# EAGLE design Design (EAGLE 9.6.2)
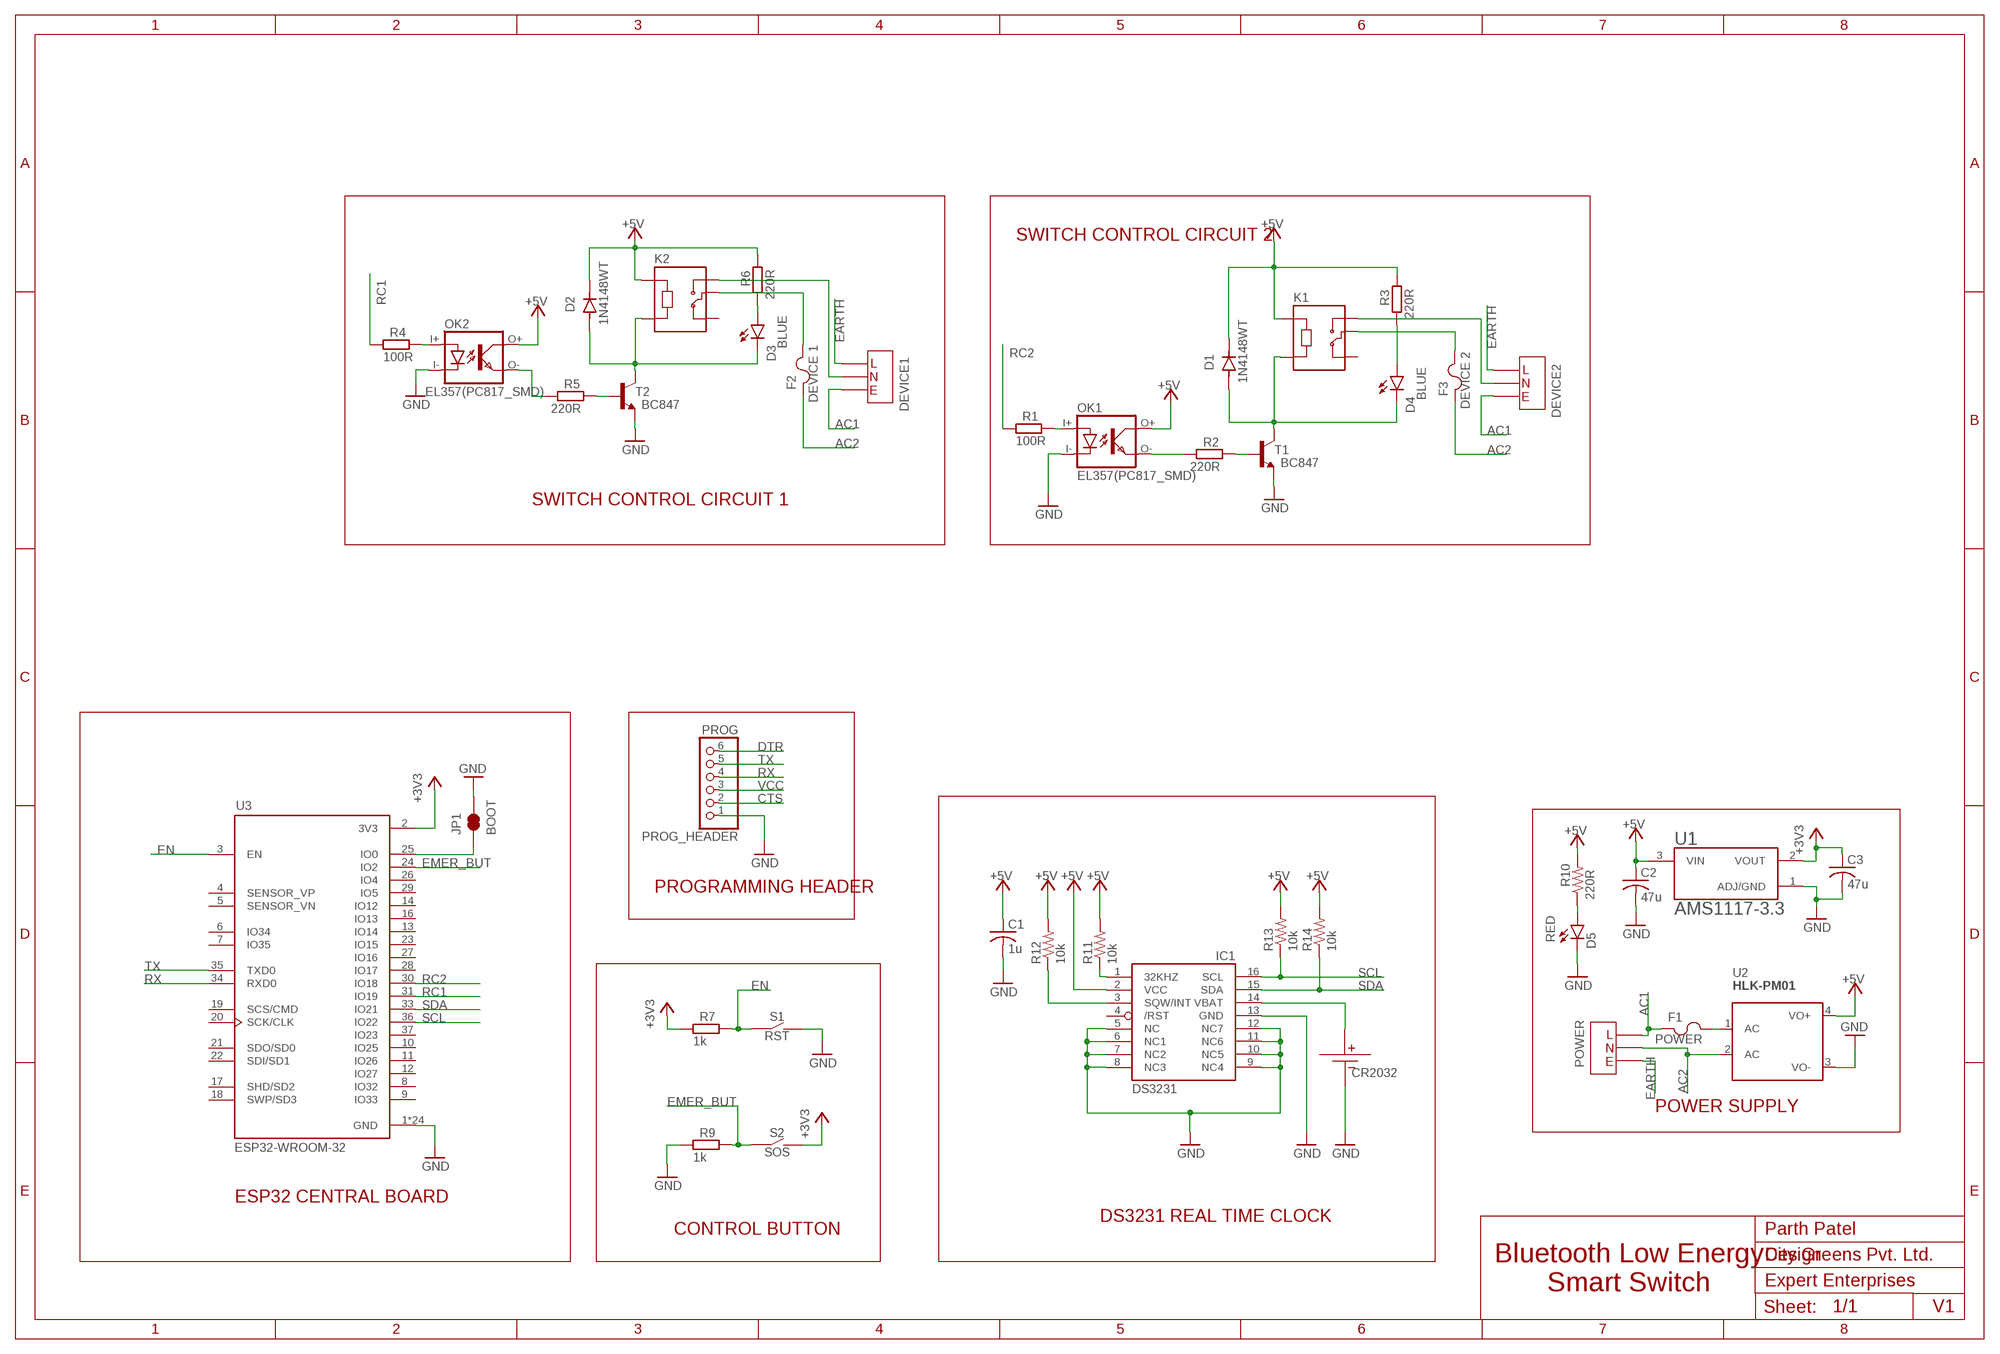
[diagram p0: schematic, sheet 1]

## Parts
C1  1u  C-USC0805  [C0805]
C2  47u  C-USC0805  [C0805]
C3  47u  C-USC0805  [C0805]
CR2032  CR3032-METAL  [CR2032-METAL]
D1  1N4148WT  [SODFL1608X70N]
D2  1N4148WT  [SODFL1608X70N]
D3  BLUE  LEDCHIP-LED0603  [CHIP-LED0603]
D4  BLUE  LEDCHIP-LED0603  [CHIP-LED0603]
D5  RED  LEDCHIP-LED0603  [CHIP-LED0603]
DEVICE1  DEVICE 1  AC_SMD_PADS  [AC_SMD_PADS]
DEVICE2  DEVICE 2  AC_SMD_PADS  [AC_SMD_PADS]
F1  POWER  TX.XA_RECTANGULAR_FUSE  [TXXA-RECTANGULAR-FUSE]
F2  DEVICE 1  TX.XA_RECTANGULAR_FUSE  [TXXA-RECTANGULAR-FUSE]
F3  DEVICE 2  TX.XA_RECTANGULAR_FUSE  [TXXA-RECTANGULAR-FUSE]
IC1  DS3231/SO  [SO16W]
JP1  BOOT  JUMPER-SMT_2_NC_TRACE_NO-SILK  [SMT-JUMPER_2_NC_TRACE_NO-SILK]
K1  SRD-05VDC-SL-C  [RELAY_SRD-05VDC-SL-C]
K2  SRD-05VDC-SL-C  [RELAY_SRD-05VDC-SL-C]
OK1  EL357(PC817_SMD)  [SOP254P715X240-4N]
OK2  EL357(PC817_SMD)  [SOP254P715X240-4N]
POWER  POWER  AC_SMD_PADS  [AC_SMD_PADS]
PROG_HEADER  PROG  PINHD-1X6  [1X06]
R1  100R  R-EU_R0805  [R0805]
R2  220R  R-EU_R0805  [R0805]
R3  220R  R-EU_R0805  [R0805]
R4  100R  R-EU_R0805  [R0805]
R5  220R  R-EU_R0805  [R0805]
R6  220R  R-EU_R0805  [R0805]
R7  1k  R-EU_R0805  [R0805]
R9  1k  R-EU_R0805  [R0805]
R10  220R  R-US_R0805  [R0805]
R11  10k  R-US_R0805  [R0805]
R12  10k  R-US_R0805  [R0805]
R13  10k  R-US_R0805  [R0805]
R14  10k  R-US_R0805  [R0805]
S1  RST  4.5X4.5-SMD-TACTILE-SWITCH  [SMD-4.5X4.5-TACTILE-PUSH-BUTTON]
S2  SOS  4.5X4.5-SMD-TACTILE-SWITCH  [SMD-4.5X4.5-TACTILE-PUSH-BUTTON]
T1  BC847  [SOT23]
T2  BC847  [SOT23]
U1  AMS1117-3.3  [SOT229P700X180-4N]
U2  HLK-PM01  [HLK-PM01]
U3  ESP32-WROOM-32  [MODULE_ESP32-WROOM-32]

## Nets
+3V3: C3.1 R7.1 S2.2.1(S2) S2.2.2(S2) U1.2(VOUT) U3.2(3V3)
+5V: C1.1 C2.1 D1.D+ D2.D+ IC1.2(VCC) K1.A1 K2.A1 OK1.O+ OK2.O+ R3.2 R6.2 R10.2 R11.2 R12.2 R13.2 R14.2 U1.3(VIN) U2.4(VO+)
AC1: DEVICE1.P$1 DEVICE2.P$1 F1.P$1 POWER.P$1
AC2: F2.P$1 F3.P$1 POWER.P$2 U2.2(AC)
CTS: PROG_HEADER.2
DTR: PROG_HEADER.6
EARTH: DEVICE1.P$3 DEVICE2.P$3 POWER.P$3
EMER_BUT: R9.2 S2.1.1(S1) S2.1.2(S1) U3.24(IO2)
EN: R7.2 S1.1.1(S1) S1.1.2(S1) U3.3(EN)
GND: C1.2 C2.2 C3.2 CR2032.-VE1(-VE) CR2032.-VE2(-VE) D5.C IC1.5(NC) IC1.6(NC1) IC1.7(NC2) IC1.8(NC3) IC1.9(NC4) IC1.10(NC5) IC1.11(NC6) IC1.12(NC7) IC1.13(GND) JP1.2 OK1.I- OK2.I- PROG_HEADER.1 R9.1 S1.2.1(S2) S1.2.2(S2) T1.2(E) T2.2(E) U1.1(ADJ/GND) U2.3(VO-) U3.1(GND) U3.15(GND) U3.38(GND) U3.39_1(GND) U3.39_2(GND) U3.39_3(GND) U3.39_4(GND) U3.39_5(GND) U3.39_6(GND) U3.39_7(GND) U3.39_8(GND) U3.39_9(GND) U3.39_10(GND) U3.39_11(GND) U3.39_12(GND) U3.39_13(GND) U3.39_14(GND) U3.39_15(GND) U3.39_16(GND) U3.39_17(GND) U3.39_18(GND) U3.39_19(GND) U3.39_20(GND) U3.39_21(GND)
N$1: F1.P$2 U2.1(AC)
N$2: OK1.O- R2.1
N$3: OK1.I+ R1.2
N$4: R2.2 T1.1(B)
N$5: IC1.1(32KHZ) R11.1
N$6: D1.D- D4.C K1.A2 T1.3(C)
N$7: D4.A R3.1
N$8: DEVICE2.P$2 K1.NO
N$9: OK2.I+ R4.2
N$10: OK2.O- R5.1
N$11: R5.2 T2.1(B)
N$12: D2.D- D3.C K2.A2 T2.3(C)
N$13: D3.A R6.1
N$14: F2.P$2 K2.COM
N$15: DEVICE1.P$2 K2.NO
N$16: F3.P$2 K1.COM
N$17: D5.A R10.1
N$18: IC1.3(SQW/INT) R12.1
N$19: CR2032.+VE IC1.14(VBAT)
N$20: JP1.1 U3.25(IO0)
RC1: R4.1 U3.31(IO19)
RC2: R1.1 U3.30(IO18)
RX: PROG_HEADER.4 U3.34(RXD0)
SCL: IC1.16(SCL) R13.1 U3.36(IO22)
SDA: IC1.15(SDA) R14.1 U3.33(IO21)
TX: PROG_HEADER.5 U3.35(TXD0)
VCC: PROG_HEADER.3
Unconnected: IC1.4(/RST) K1.NC K2.NC U3.4(SENSOR_VP) U3.5(SENSOR_VN) U3.6(IO34) U3.7(IO35) U3.8(IO32) U3.9(IO33) U3.10(IO25) U3.11(IO26) U3.12(IO27) U3.13(IO14) U3.14(IO12) U3.16(IO13) U3.17(SHD/SD2) U3.18(SWP/SD3) U3.19(SCS/CMD) U3.20(SCK/CLK) U3.21(SDO/SD0) U3.22(SDI/SD1) U3.23(IO15) U3.26(IO4) U3.27(IO16) U3.28(IO17) U3.29(IO5) U3.37(IO23)

## Notes on the sheet
- SWITCH CONTROL CIRCUIT 2
- SWITCH CONTROL CIRCUIT 1
- PROGRAMMING HEADER
- POWER SUPPLY
- ESP32 CENTRAL BOARD
- DS3231 REAL TIME CLOCK
- CONTROL BUTTON | Parth Patel
- City Greens Pvt. Ltd.
- Bluetooth Low Energy
  Smart Switch
- Expert Enterprises
- V1

## Library data of the parts
C1-C3 = rcl:C-US: CAPACITOR, American symbol; SPICEPREFIX: C
CR2032 = Battery Holder:CR3032-METAL
D1 = 1N4148WT:1N4148WT: Diode Switching 100V 0.125A 2-Pin SOD-523 Check availability <https://pricing.snapeda.com/parts/1N4148WT/ON%20Semiconductor/view-part?ref=eda>
D2 = 1N4148WT:1N4148WT: Diode Switching 100V 0.125A 2-Pin SOD-523 Check availability <https://pricing.snapeda.com/parts/1N4148WT/ON%20Semiconductor/view-part?ref=eda>; SPICEPREFIX: D
D3-D5 = led:LED: LED OSRAM: - CHIPLED LG R971, LG N971, LY N971, LG Q971, LY Q971, LO R971, LY R971 LH N974, LH R974 LS Q976, LO Q976, LY Q976 LO Q996 - Hyper CHIPLED LW Q18S LB Q993, LB Q99A, LB R99A - SideLED LS A670, LO A670, LY A670, LG A670, LP A670 LB A673, LV A673, LT A673, LW A673 LH A674 LY A675 LS A676, LA A676, LO A676, LY A676, LW A676 LS A679, LY A679, LG A679 - Hyper Micro SIDELED® LS Y876, LA Y876, LO Y876, LY Y876 LT Y87S - SmartLED LW L88C, LW L88S LB L89C, LB L89S, LG L890 LS L89K, LO L89K, LY L89K LS L896, LA L896, LO L896, LY L896 - TOPLED LS T670, LO T670, LY T670, LG T670, LP T670 LSG T670, LSP T670, LSY T670, LOP T670, LYG T670 LG T671, LOG T671, LSG T671 LB T673, LV T673, LT T673, LW T673 LH T674 LS T676, LA T676, LO T676, LY T676, LB T676, LH T676, LSB T676, LW T676 LB T67C, LV T67C, LT T67C, LS T67K, LO T67K, LY T67K, LW E67C LS E67B, LA E67B, LO E67B, LY E67B, LB E67C, LV E67C, LT E67C LW T67C LS T679, LY T679, LG T679 LS T770, LO T770, LY T770, LG T770, LP T770 LB T773, LV T773, LT T773, LW T773 LH T774 LS E675, LA E675, LY E675, LS T675 LS T776, LA T776, LO T776, LY T776, LB T776 LHGB T686 LT T68C, LB T68C - Hyper Mini TOPLED® LB M676 - Mini TOPLED Santana® LG M470 LS M47K, LO M47K, LY M47K Source: http://www.osram.convergy.de LUXEON: - LUMILED® LXK2-PW12-R00, LXK2-PW12-S00, LXK2-PW14-U00, LXK2-PW14-V00 LXK2-PM12-R00, LXK2-PM12-S00, LXK2-PM14-U00 LXK2-PE12-Q00, LXK2-PE12-R00, LXK2-PE12-S00, LXK2-PE14-T00, LXK2-PE14-U00 LXK2-PB12-K00, LXK2-PB12-L00, LXK2-PB12-M00, LXK2-PB14-N00, LXK2-PB14-P00, LXK2-PB14-Q00 LXK2-PR12-L00, LXK2-PR12-M00, LXK2-PR14-Q00, LXK2-PR14-R00 LXK2-PD12-Q00, LXK2-PD12-R00, LXK2-PD12-S00 LXK2-PH12-R00, LXK2-PH12-S00 LXK2-PL12-P00, LXK2-PL12-Q00, LXK2-PL12-R00 Source: www.luxeon.com KINGBRIGHT: KA-3528ASYC Source: www.kingbright.com
DEVICE1 DEVICE2 POWER = AC_SMD_Pads:AC_SMD_PADS
F1-F3 = Fuse:TX.XA_RECTANGULAR_FUSE
IC1 = DS3231:DS3231: Check availability <https://pricing.snapeda.com/parts/DS3231/Maxim%20Integrated/view-part?ref=eda>; AVAILABILITY: In Stock; DESCRIPTION: Real Time Clock (RTC) IC Clock/Calendar - I²C, 2-Wire Serial 8-SOIC (0.154, 3.90mm Width); MF: Maxim Integrated; MP: DS3231; PACKAGE: SOIC-16 Maxim Integrated; PRICE: None; PURCHASE-URL: https://pricing.snapeda.com/search/part/DS3231/?ref=eda
JP1 = SparkFun-Jumpers:JUMPER-SMT_2_NC_TRACE: Normally closed trace jumper This jumper has a trace between two pads so it's normally closed (NC). Use a razor knife to open the connection. For best results follow the IPC guidelines for cutting traces: Cutout at least 0.063 mm (0.005 in). Remove all loose material to clean up the cut area. Seal the cut with an approved epoxy. Reapply solder to reclose the connection.
K1 K2 = SRD-05VDC-SL-C:SRD-05VDC-SL-C: 5V Trigger Relay Module For Arduino And Raspberry Pi 5V Trigger Relay Module For Arduino And Raspberry Pi Check availability <https://pricing.snapeda.com/parts/SRD-05VDC-SL-C/Songle%20Relay/view-part?ref=eda>; AVAILABILITY: In Stock; DESCRIPTION: 5V Trigger Relay Module For Arduino And Raspberry Pi 5V Trigger Relay Module For Arduino And Raspberry Pi; MF: Songle Relay; MP: SRD-05VDC-SL-C; PACKAGE: None; PRICE: None
OK1 OK2 = Optocoupler:EL357(PC817_SMD)
PROG_HEADER = pinhead:PINHD-1X6: PIN HEADER
R1-R7 R9 = rcl:R-EU_: RESISTOR, European symbol; SPICEPREFIX: R
R10-R14 = rcl:R-US_: RESISTOR, American symbol; SPICEPREFIX: R
S1 S2 = Switches:4.5X4.5-SMD-TACTILE-SWITCH
T1 T2 = transistor:BC847: NPN TRANSISTOR
U1 = AMS1117-3.3:AMS1117-3.3: Sot223/Pkg 1-Amp 3.3-Volt Low Drop Out Voltage Regulatator Check availability <https://pricing.snapeda.com/parts/AMS1117-3.3/AMD/view-part?ref=eda>; AVAILABILITY: Not in stock; DESCRIPTION: LDO Voltage Regulators 800MA LDO LINEAR REG; MF: AMD; MP: AMS1117-3.3; PACKAGE: None; PRICE: None
U2 = Hi-Link AC to DC Power Supply:HLK-PM01: Check prices <https://pricing.snapeda.com/parts/hlk-pm01/Hi-link/view-part?ref=eda>; AVAILABILITY: Not in stock; DESCRIPTION: The 3W ultra-small series module power supply is a small-volume, high-efficiency AC DC power module supply designed by Shenzhen Hi-Link Electronics Co.,Ltd. It has the advantages of global input voltage range, low temperature rise, low power consumption,high efficiency, high reliability and high safety isolation. It has been widely used in smart home, automation control, communications equipment, instrumentation and other industries.; MF: Hi-link; MP: hlk-pm01; PACKAGE: None; PRICE: None
U3 = ESP32-WROOM-32:ESP32-WROOM-32: Bluetooth, WiFi Transceiver Module 2.4GHz ~ 2.5GHz Surface Mount Check availability <https://pricing.snapeda.com/parts/ESP32-WROOM-32/Espressif%20Systems/view-part?ref=eda>; AVAILABILITY: In Stock; DESCRIPTION: Bluetooth, WiFi 802.11b/g/n, Bluetooth v4.2 +EDR, Class 1, 2 and 3 Transceiver Module 2.4GHz ~ 2.5GHz Antenna Not Included, U.FL Surface Mount; MF: Espressif Systems; MP: ESP32-WROOM-32; PACKAGE: Module Espressif Systems; PRICE: None; PURCHASE-URL: https://pricing.snapeda.com/search/part/ESP32-WROOM-32/?ref=eda

## Board
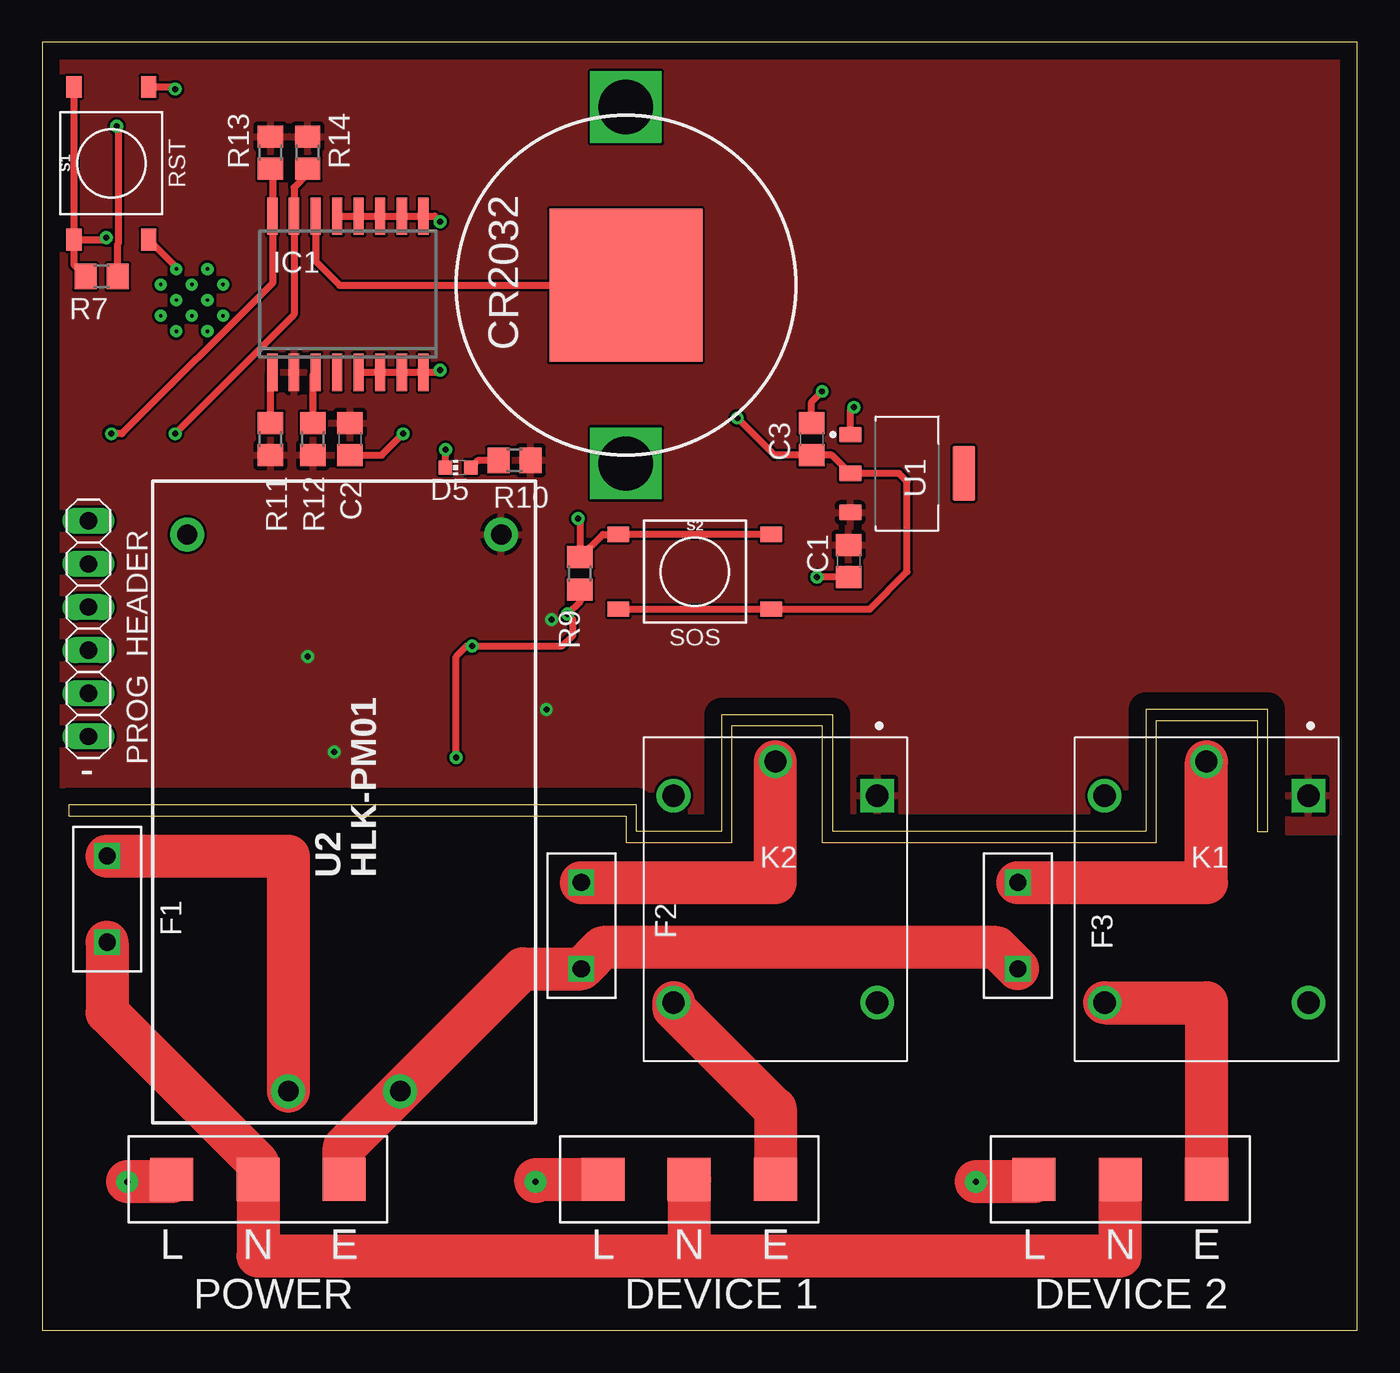
[diagram p1: board, top side]
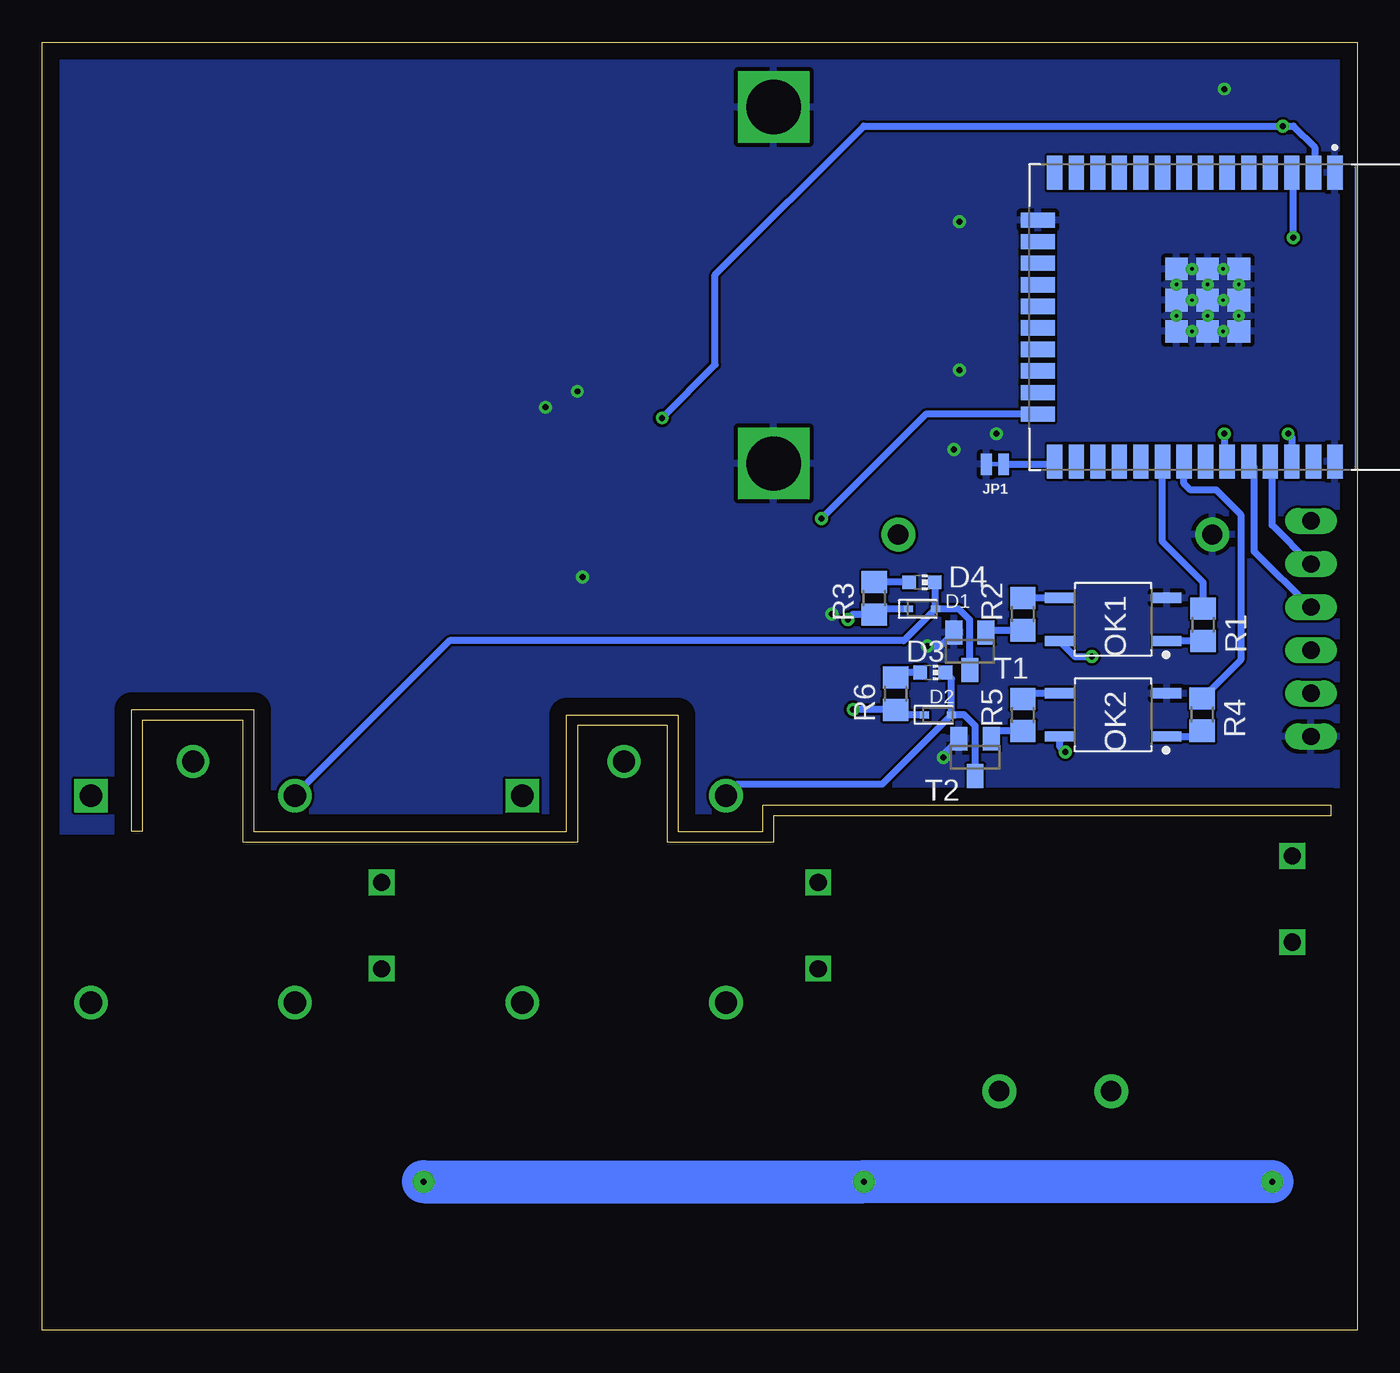
[diagram p2: board, bottom side, seen from below]

Size 77.45 x 75.87 mm. Coordinates in mm from the lower left corner, seen from the top.
Outline: 0,0 77.45,0 77.45,75.87 0,75.87 0,0
Outline: 34.38,28.75 40.62,28.75 40.62,35.62 45.94,35.62 45.94,28.75 65.62,28.75 65.62,35.94 71.56,35.94 71.56,29.38 72.19,29.38 72.19,36.56 65,36.56 65,29.38 46.56,29.38 46.56,36.25 40,36.25 40,29.38 35,29.38 35,30.94 1.56,30.94 1.56,30.31 34.38,30.31 34.38,28.75
Copper layers (1*16): Top 0.035mm / dielectric 1.5mm / Bottom 0.035mm
Design rules "default *": minimum track width 6mil, minimum drill 0.35mm, track to track 6mil, track to pad 6mil, pad to pad 6mil, via to via 6mil, smd to smd 6mil, copper to edge 40mil, drill to drill 6mil, minimum pad ring 10mil, minimum via ring 8mil, stop-mask expansion 4mil, vias tented up to drill 20mil, thermal gap 10mil

### Footprints (pad centres in the part's own frame; a part is rotated, then mirrored left to right if it is on the bottom)
C0805 = smd 1.3 x 1.5: 1 -0.95,0; 2 0.95,0
CR2032-METAL = smd 9 x 9: +VE 0,0 | drill 3.2 square: -VE1 -10.5,0; -VE2 10.5,0
SODFL1608X70N = smd 0.538 x 0.4: D+ -0.796,0; D- 0.796,0
CHIP-LED0603 = smd 0.8 x 0.8: A 0,-0.75; C 0,0.75
AC_SMD_PADS = smd 2.54 x 2.54: P$1 0,0; P$2 5.08,0; P$3 -5.08,0
TXXA-RECTANGULAR-FUSE = drill 1.01 square: P$1 -2.54,0; P$2 2.54,0
SO16W = smd 0.6 x 2.2: 1 -4.445,-4.6; 2 -3.175,-4.6; 3 -1.905,-4.6; 4 -0.635,-4.6; 5 0.635,-4.6; 6 1.905,-4.6; 7 3.175,-4.6; 8 4.445,-4.6; 9 4.445,4.6; 10 3.175,4.6; 11 1.905,4.6; 12 0.635,4.6; 13 -0.635,4.6; 14 -1.905,4.6; 15 -3.175,4.6; 16 -4.445,4.6
SMT-JUMPER_2_NC_TRACE_NO-SILK = smd 0.635 x 1.27: 1 -0.508,0; 2 0.508,0
RELAY_SRD-05VDC-SL-C = drill 1.32 square: A1 -6.1,6 | drill 1.32: A2 -6.1,-6; NC 6.1,6; NO 6.1,-6 | drill 1.29: COM -8.1,0
SOP254P715X240-4N = smd 1.714 x 0.61: I+ -3.153,1.27; I- -3.153,-1.27; O+ 3.153,1.27; O- 3.153,-1.27
1X06 = drill 1.016 long: 1 -6.35,0; 2 -3.81,0; 3 -1.27,0; 4 1.27,0; 5 3.81,0; 6 6.35,0
R0805 = smd 1.3 x 1.5: 1 -0.95,0; 2 0.95,0
SMD-4.5X4.5-TACTILE-PUSH-BUTTON = smd 1.27 x 0.9: 1.1 -4.5,2.2; 1.2 4.5,2.2; 2.1 -4.5,-2.2; 2.2 4.5,-2.2
SOT23 = smd 1 x 1.4: 1 -0.95,-1.1; 2 0.95,-1.1; 3 0,1.1
SOT229P700X180-4N = smd 0.93 x 1.31: 1 -2.29,-3.345; 2 0,-3.345; 3 2.29,-3.345 | smd 3.24 x 1.31: 4 0,3.345
HLK-PM01 = drill 1.2 pad 2: 1 -16.4,3.3; 2 -16.4,-3.3; 3 16.4,9.25; 4 16.4,-9.25
MODULE_ESP32-WROOM-32 = smd 2 x 0.9: 1 -8.5,5.26; 2 -8.5,3.99; 3 -8.5,2.72; 4 -8.5,1.45; 5 -8.5,0.18; 6 -8.5,-1.09; 7 -8.5,-2.36; 8 -8.5,-3.63; 9 -8.5,-4.9; 10 -8.5,-6.17; 11 -8.5,-7.44; 12 -8.5,-8.71; 13 -8.5,-9.98; 14 -8.5,-11.25; 25 8.5,-11.25; 26 8.5,-9.98; 27 8.5,-8.71; 28 8.5,-7.44; 29 8.5,-6.17; 30 8.5,-4.9; 31 8.5,-3.63; 32 8.5,-2.36; 33 8.5,-1.09; 34 8.5,0.18; 35 8.5,1.45; 36 8.5,2.72; 37 8.5,3.99; 38 8.5,5.26 | smd 0.9 x 2: 15 -5.715,-12.25; 16 -4.445,-12.25; 17 -3.175,-12.25; 18 -1.905,-12.25; 19 -0.635,-12.25; 20 0.635,-12.25; 21 1.905,-12.25; 22 3.175,-12.25; 23 4.445,-12.25; 24 5.715,-12.25 | smd 1.33 x 1.33: 39_1 -2.835,-0.405; 39_2 -1,-0.405; 39_3 0.835,-0.405; 39_4 -2.835,-2.24; 39_5 -1,-2.24; 39_6 0.835,-2.24; 39_7 -2.835,-4.075; 39_8 -1,-4.075; 39_9 0.835,-4.075 | drill 0.2 pad 0.3: 39_10 -1.917,-0.405; 39_11 -0.083,-0.405; 39_12 -2.835,-1.323; 39_13 -1,-1.323; 39_14 0.835,-1.323; 39_15 -1.917,-2.24; 39_16 -0.083,-2.24; 39_17 -2.835,-3.158; 39_18 -1,-3.158; 39_19 0.835,-3.158; 39_20 -1.917,-4.075; 39_21 -0.083,-4.075

### Placement (x,y rotation side)
C1  47.5,45.31 270 top
C2  18.12,52.5 270 top
C3  45.31,52.5 90 top
CR2032  34.38,61.56 90 top
D1  25.62,42.5 0 bottom
D2  24.69,36.25 0 bottom
D3  25,38.75 270 bottom
D4  25.62,44.06 270 bottom
D5  24.5,50.82 90 top
DEVICE1  38.1,8.89 0 top
DEVICE2  63.5,8.89 0 top
F1  3.81,25.4 90 top
F2  31.75,23.84 90 top
F3  57.46,23.84 90 top
IC1  18,61.04 0 top
JP1  21.32,51.02 180 bottom
K1  68.58,25.4 270 top
K2  43.18,25.4 270 top
OK1  14.38,41.88 180 bottom
OK2  14.38,36.25 180 bottom
POWER  12.7,8.89 0 top
PROG_HEADER  2.71,41.33 90 top
R1  9.06,41.56 270 bottom
R2  19.69,42.19 270 bottom
R3  28.44,43.12 270 bottom
R4  9.13,36.27 270 bottom
R5  19.69,36.25 270 bottom
R6  27.19,37.5 270 bottom
R7  3.49,62.09 180 top
R9  31.66,44.59 90 top
R10  27.81,51.25 0 top
R11  13.44,52.5 270 top
R12  15.94,52.5 270 top
R13  13.44,69.38 90 top
R14  15.62,69.38 90 top
S1  4.06,68.75 90 top
S2  38.44,44.69 0 top
T1  22.81,40 180 bottom
T2  22.5,33.75 180 bottom
U1  50.94,50.48 270 top
U2  17.78,30.48 90 top
U3  6.56,59.69 270 bottom

### Tracks (layer width: path | path; a pad name or v marks a point on that pad's centre or on a via)
+3V3  (via drill 0.35)
  Top 0.406: v40.94,53.75 43.14,51.55 C3.1 46.52,51.55 U1.2 50.46,50.48 50.94,50 50.94,44.69 48.74,42.49 S2.2.2 S2.2.1 | R7.1 4.44,64.03 4.48,64.07 4.48,70.83 v4.38,70.94
  Bottom 0.406: v40.94,53.75 37.81,56.88 37.81,62.19 29.06,70.94 v4.38,70.94 3.75,70.94 2.5,69.69 2.5,68.26 U3.2
+5V  (via drill 0.35)
  Bottom 0.406: R6.2 27.19,36.56 | 27.19,36.56 v29.69,36.56 | OK2.O+ 17.53,34.4 v17.19,34.06 | OK1.O+ 16.61,39.69 v15.62,39.69 | v30,41.88 29.7,42.17 R3.2 28.11,42.5 D1.D+ | D2.D+ 26.88,36.25 27.19,36.56
  pour Top: 0,30.94 35,30.94 35,29.38 40,29.38 40,36.25 46.56,36.25 46.56,29.38 65,29.38 65,36.56 72.19,36.56 72.19,29.38 77.5,29.38 77.5,75.94 0,75.94
AC1
  Top 2.54: F1.P$1 3.81,18.72 12.7,9.83 POWER.P$1 12.7,4.38 38.12,4.38 | 38.12,4.38 38.12,8.89 DEVICE1.P$1 | 38.12,4.38 63.5,4.38 DEVICE2.P$1
AC2
  Top 2.54: POWER.P$2 17.78,10.78 U2.2 28.3,21.3 F2.P$1 33,22.55 56.21,22.55 F3.P$1
EARTH  (via drill 0.35 pad 1.3)
  Top 2.54: POWER.P$3 7.62,8.75 v5,8.75 | v29.06,8.75 29.06,8.89 DEVICE1.P$3 | DEVICE2.P$3 58.42,8.75 v55,8.75
  Bottom 2.54: v5,8.75 v29.06,8.75 v55,8.75
EMER_BUT  (via drill 0.35)
  Top 0.406: S2.1.2 S2.1.1 33.01,46.89 R9.2 31.66,47.71 v31.56,47.81
  Bottom 0.406: U3.24 25.4,53.97 v31.56,47.81
EN  (via drill 0.35)
  Top 0.406: S1.1.1 S1.1.2 | R7.2 1.86,62.76 S1.1.1 | S1.1.1 3.62,64.25 v3.75,64.38
  Bottom 0.406: v3.75,64.38 3.75,68.09 U3.3
GND  (via drill 0.35)
  Top 0.406: R9.1 31.66,42.91 v30.94,42.19 31.25,41.88 31.25,40.94 30.62,40.31 v25.31,40.31 25,40.31 24.38,39.69 v24.38,33.75 | C3.2 45.31,54.69 v45.94,55.31 | U1.1 47.59,54.16 v47.81,54.38 | C1.2 45.64,44.36 v45.62,44.38 | IC1.5 IC1.6 IC1.7 IC1.8 23.31,56.44 v23.44,56.56 | IC1.13 IC1.12 IC1.11 IC1.10 IC1.9 23.11,65.64 v23.44,65.31 | S1.2.1 7.88,62.63 U3.39_12 | S1.2.2 7.69,73.25 v7.81,73.12 | D5.C v23.75,51.88 | C2.2 19.99,51.55 v21.25,52.81
  Bottom 0.406: T2.2 24.38,33.92 v24.38,33.75 | v25.31,40.31 24.55,40.31 T1.2
  pour Bottom: 0,30.94 35,30.94 35,29.38 40,29.38 40,36.25 46.56,36.25 46.56,29.38 65,29.38 65,36.56 72.19,36.56 72.19,29.38 77.5,29.38 77.5,75.94 0,75.94
N$1
  Top 2.54: U2.1 14.48,27.94 F1.P$2
N$2
  Bottom 0.406: OK1.O- R2.1
N$3
  Bottom 0.406: R1.2 11.21,40.61 OK1.I+
N$4
  Bottom 0.406: R2.2 21.73,41.24 T1.1
N$5
  Top 0.406: R11.1 13.44,56.33 IC1.1
N$6
  Bottom 0.406: D1.D- 24.83,44.02 D4.C | K1.A2 53.45,40.62 26.7,40.62 D1.D- | T1.3 22.81,41.85 23.46,42.5 D1.D-
N$7
  Bottom 0.406: D4.A 26.39,44.08 R3.1
N$8
  Top 2.54: K1.NO 68.58,19.3 DEVICE2.P$2
N$9
  Bottom 0.406: OK2.I+ 9.13,34.98 R4.2
N$10
  Bottom 0.406: OK2.O- 19.69,37.52 R5.1
N$11
  Bottom 0.406: R5.2 21.1,35.3 T2.1
N$12
  Bottom 0.406: D2.D- 23.89,38.39 D3.C | D2.D- 27.98,32.16 36.52,32.16 K2.A2 | T2.3 22.5,35.6 23.15,36.25 D2.D-
N$13
  Bottom 0.406: D3.A 26.89,38.75 R6.1
N$14
  Top 2.54: F2.P$2 43.18,26.38 K2.COM
N$15
  Top 2.54: K2.NO 37.18,18.99 43.12,13.05 43.18,13.05 DEVICE1.P$2
N$16
  Top 2.54: F3.P$2 68.58,26.38 K1.COM
N$17
  Top 0.406: D5.A 25.68,51.25 R10.1
N$18
  Top 0.406: R12.1 15.94,56.28 IC1.3
N$19
  Top 0.406: IC1.14 16.09,62.97 17.5,61.56 CR2032.+VE
N$20
  Bottom 0.406: JP1.1 17.98,51.02 U3.25
RC1
  Bottom 0.406: R4.1 6.86,39.49 6.86,48.07 8.3,49.51 9.82,49.51 10.19,49.88 U3.31
RC2
  Bottom 0.406: R1.1 9.06,44.06 11.46,46.46 U3.30
RX
  Bottom 0.406: PROG_HEADER.4 2.77,42.6 6.07,45.91 6.07,50.88 U3.34
SCL  (via drill 0.35)
  Top 0.406: R13.1 13.55,68.31 IC1.16 13.55,61.68 4.68,52.81 v4.06,52.81
  Bottom 0.406: v4.06,52.81 3.84,52.59 U3.36
SDA  (via drill 0.35)
  Top 0.406: R14.1 15.62,68.12 14.82,67.32 IC1.15 14.82,59.82 v7.81,52.81
  Bottom 0.406: v7.81,52.81 7.81,51.35 U3.33
TX
  Bottom 0.406: U3.35 5,51.08 5,47.43 PROG_HEADER.5

### Text on the board
tPlace: -
tStop: MADE BY: PARTH PATEL / IN ASSOCIATION WITH / CITY GREENS PVT. LTD. / & / EXPERT ENTERPRISE